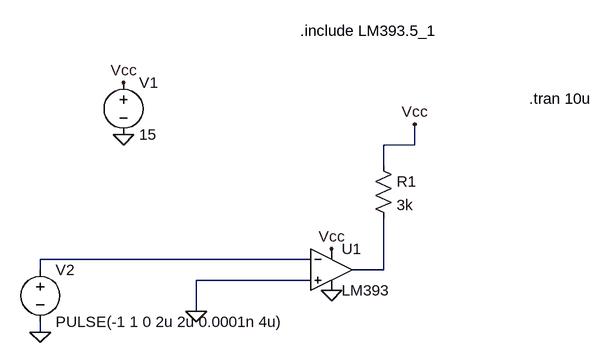
[diagram p0: schematic Draft1.asc]
Draft1.asc, the LTspice schematic file:
Version 4
SHEET 1 880 704
WIRE 288 400 288 368
WIRE 288 400 240 400
WIRE 240 432 240 400
WIRE 128 576 -288 576
WIRE -288 592 -288 576
WIRE 240 592 240 512
WIRE 240 592 192 592
WIRE 128 608 -48 608
WIRE -48 656 -48 608
WIRE -288 688 -288 672
FLAG 160 560 Vcc
FLAG 160 624 0
FLAG 288 368 Vcc
FLAG -160 304 Vcc
FLAG -160 384 0
FLAG -48 656 0
FLAG -288 688 0
SYMBOL opamp2 160 528 R0
SYMATTR InstName U1
SYMATTR Value LM393
SYMBOL res 224 416 R0
SYMATTR InstName R1
SYMATTR Value 3k
SYMBOL voltage -160 288 R0
WINDOW 123 0 0 Left 2
WINDOW 39 0 0 Left 2
SYMATTR InstName V1
SYMATTR Value 15
SYMBOL voltage -288 576 R0
SYMATTR InstName V2
SYMATTR Value PULSE(-1 1 0 2u 2u 0.0001n 4u)
TEXT 112 224 Left 2 !.include LM393.5_1
TEXT 464 328 Left 2 !.tran 10u

The netlist it stands for:
* Draft1.asc
XU1 0 N001 Vcc 0 N002 LM393  ; pins In+ In- V+ V- OUT
R1 Vcc N002 3k
V1 Vcc 0 15
V2 N001 0 PULSE(-1 1 0 2u 2u 0.0001n 4u)
.include LM393.5_1
.tran 10u
.backanno
.end